# Altium schematic sheet top_g.SchDoc
size A; SheetNumber: 1; SheetTotal: 4
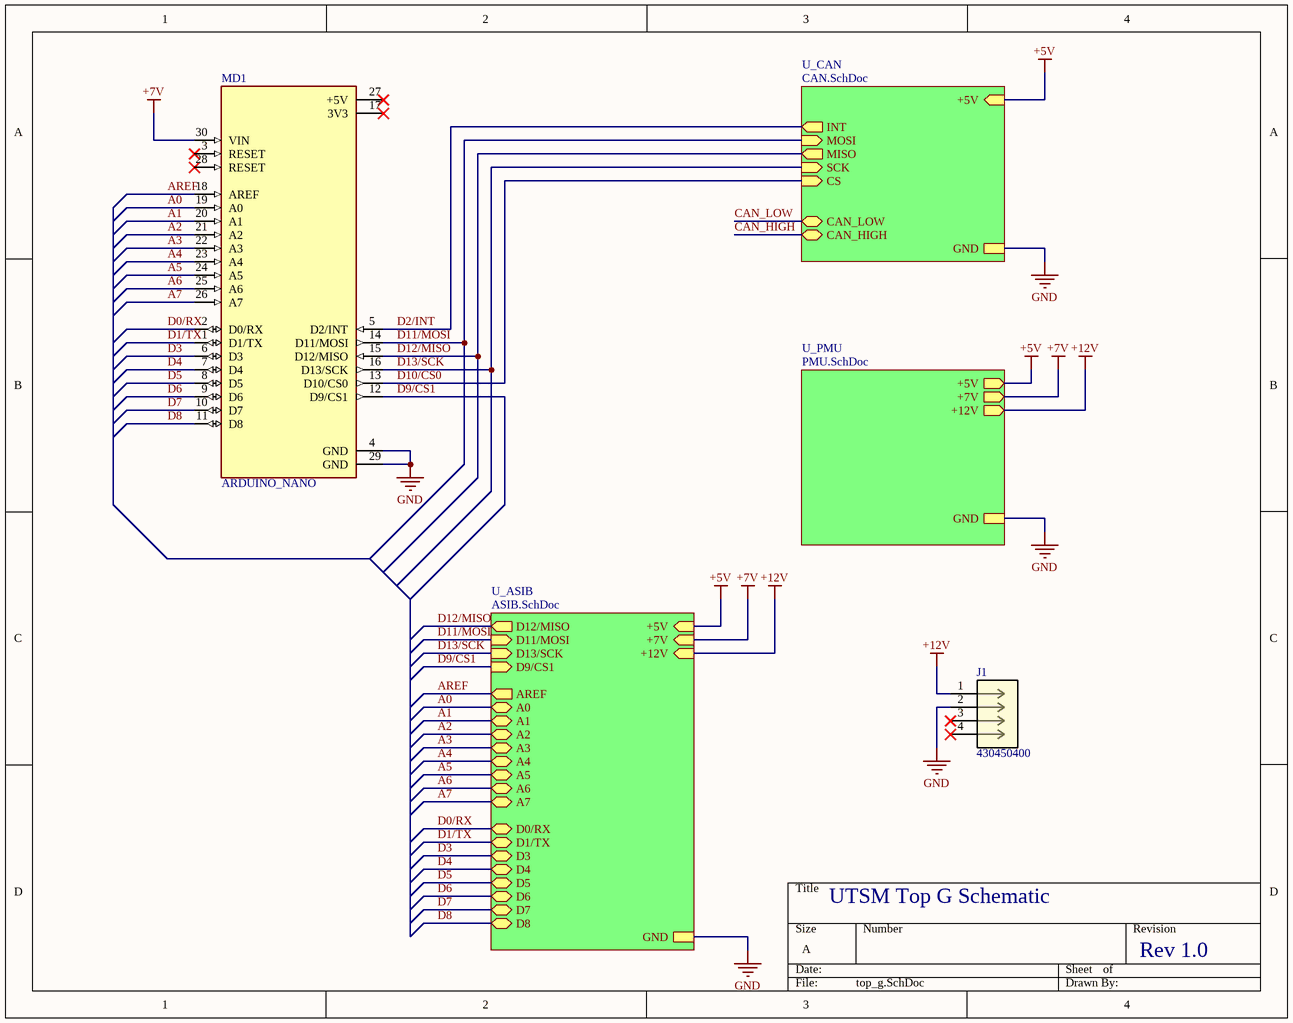
[diagram p0: top_g.SchDoc]

## Parts
J1  430450400  [CON_430450400_MOL]
MD1  ARDUINO_NANO  [SHIELD_ARDUINO_NANO]

## Sub-sheets
U_ASIB = ASIB.SchDoc: A0 (bidir), A1 (bidir), A2 (bidir), A3 (bidir), A4 (bidir), A5 (bidir), A6 (bidir), A7 (bidir), AREF (out), D0/RX (bidir), D1/TX (bidir), D3 (bidir), D4 (bidir), D5 (bidir), D6 (bidir), D7 (bidir), D8 (bidir), D9/CS1 (in), D11/MOSI (in), D12/MISO (out), D13/SCK (in), +5V (in), +7V (in), +12V (in), GND
U_CAN = CAN.SchDoc: CAN_HIGH (bidir), CAN_LOW (bidir), +5V (in), GND, MISO (out), MOSI (in), SCK (in), CS (in), INT (out)
U_PMU = PMU.SchDoc: +5V (out), +7V (out), +12V (out), GND

## Nets
+5V: sheet U_ASIB/+5V, sheet U_CAN/+5V, sheet U_PMU/+5V
+7V: MD1.30(VIN) ; sheet U_ASIB/+7V, sheet U_PMU/+7V
+12V: J1.1 ; sheet U_ASIB/+12V, sheet U_PMU/+12V
GND: J1.2 MD1.4(GND) MD1.29(GND) ; sheet U_ASIB/GND, sheet U_CAN/GND, sheet U_PMU/GND
A0: MD1.19(A0) ; sheet U_ASIB/A0
A1: MD1.20(A1) ; sheet U_ASIB/A1
A2: MD1.21(A2) ; sheet U_ASIB/A2
A3: MD1.22(A3) ; sheet U_ASIB/A3
A4: MD1.23(A4) ; sheet U_ASIB/A4
A5: MD1.24(A5) ; sheet U_ASIB/A5
A6: MD1.25(A6) ; sheet U_ASIB/A6
A7: MD1.26(A7) ; sheet U_ASIB/A7
AREF: MD1.18(AREF) ; sheet U_ASIB/AREF
CAN_HIGH: sheet U_CAN/CAN_HIGH
CAN_LOW: sheet U_CAN/CAN_LOW
D0/RX: MD1.2(D0/RX) ; sheet U_ASIB/D0/RX
D1/TX: MD1.1(D1/TX) ; sheet U_ASIB/D1/TX
D2/INT: MD1.5(D2/INT) ; sheet U_CAN/INT
D3: MD1.6(D3) ; sheet U_ASIB/D3
D4: MD1.7(D4) ; sheet U_ASIB/D4
D5: MD1.8(D5) ; sheet U_ASIB/D5
D6: MD1.9(D6) ; sheet U_ASIB/D6
D7: MD1.10(D7) ; sheet U_ASIB/D7
D8: MD1.11(D8) ; sheet U_ASIB/D8
D9/CS1: MD1.12(D9/CS1) ; sheet U_ASIB/D9/CS1
D10/CS0: MD1.13(D10/CS0) ; sheet U_CAN/CS
D11/MOSI: MD1.14(D11/MOSI) ; sheet U_ASIB/D11/MOSI, sheet U_CAN/MOSI
D12/MISO: MD1.15(D12/MISO) ; sheet U_ASIB/D12/MISO, sheet U_CAN/MISO
D13/SCK: MD1.16(D13/SCK) ; sheet U_ASIB/D13/SCK, sheet U_CAN/SCK

Not connected (* = marked no-connect by the designer): J1 3* 4*; MD1 3(RESET)* 17(3V3)* 27(+5V)* 28(RESET)*

## Notes on the sheet
- UTSM Top G Schematic
- Rev 1.0

## Library data of the parts
J1 = 430450400: +12 from Battery; Mfr_Name: Molex Connector Corporation; RefDes: RefDes; Type: Type
MD1 = ARDUINO_NANO: Small, complete, and breadboard-friendly board based on the ATmega328 (Arduino Nano 3.x); Check_prices: https://www.snapeda.com/parts/Arduino%20Nano/Arduino/view-part/?ref=eda; Value: *; Availability: Not in stock; MP: Arduino Nano; Price: None; Package: Non-Standard Arduino; SnapEDA_Link: https://www.snapeda.com/parts/Arduino%20Nano/Arduino/view-part/?ref=snap; MF: Arduino